# EAGLE design imuv1.4a (EAGLE 7.7.0)
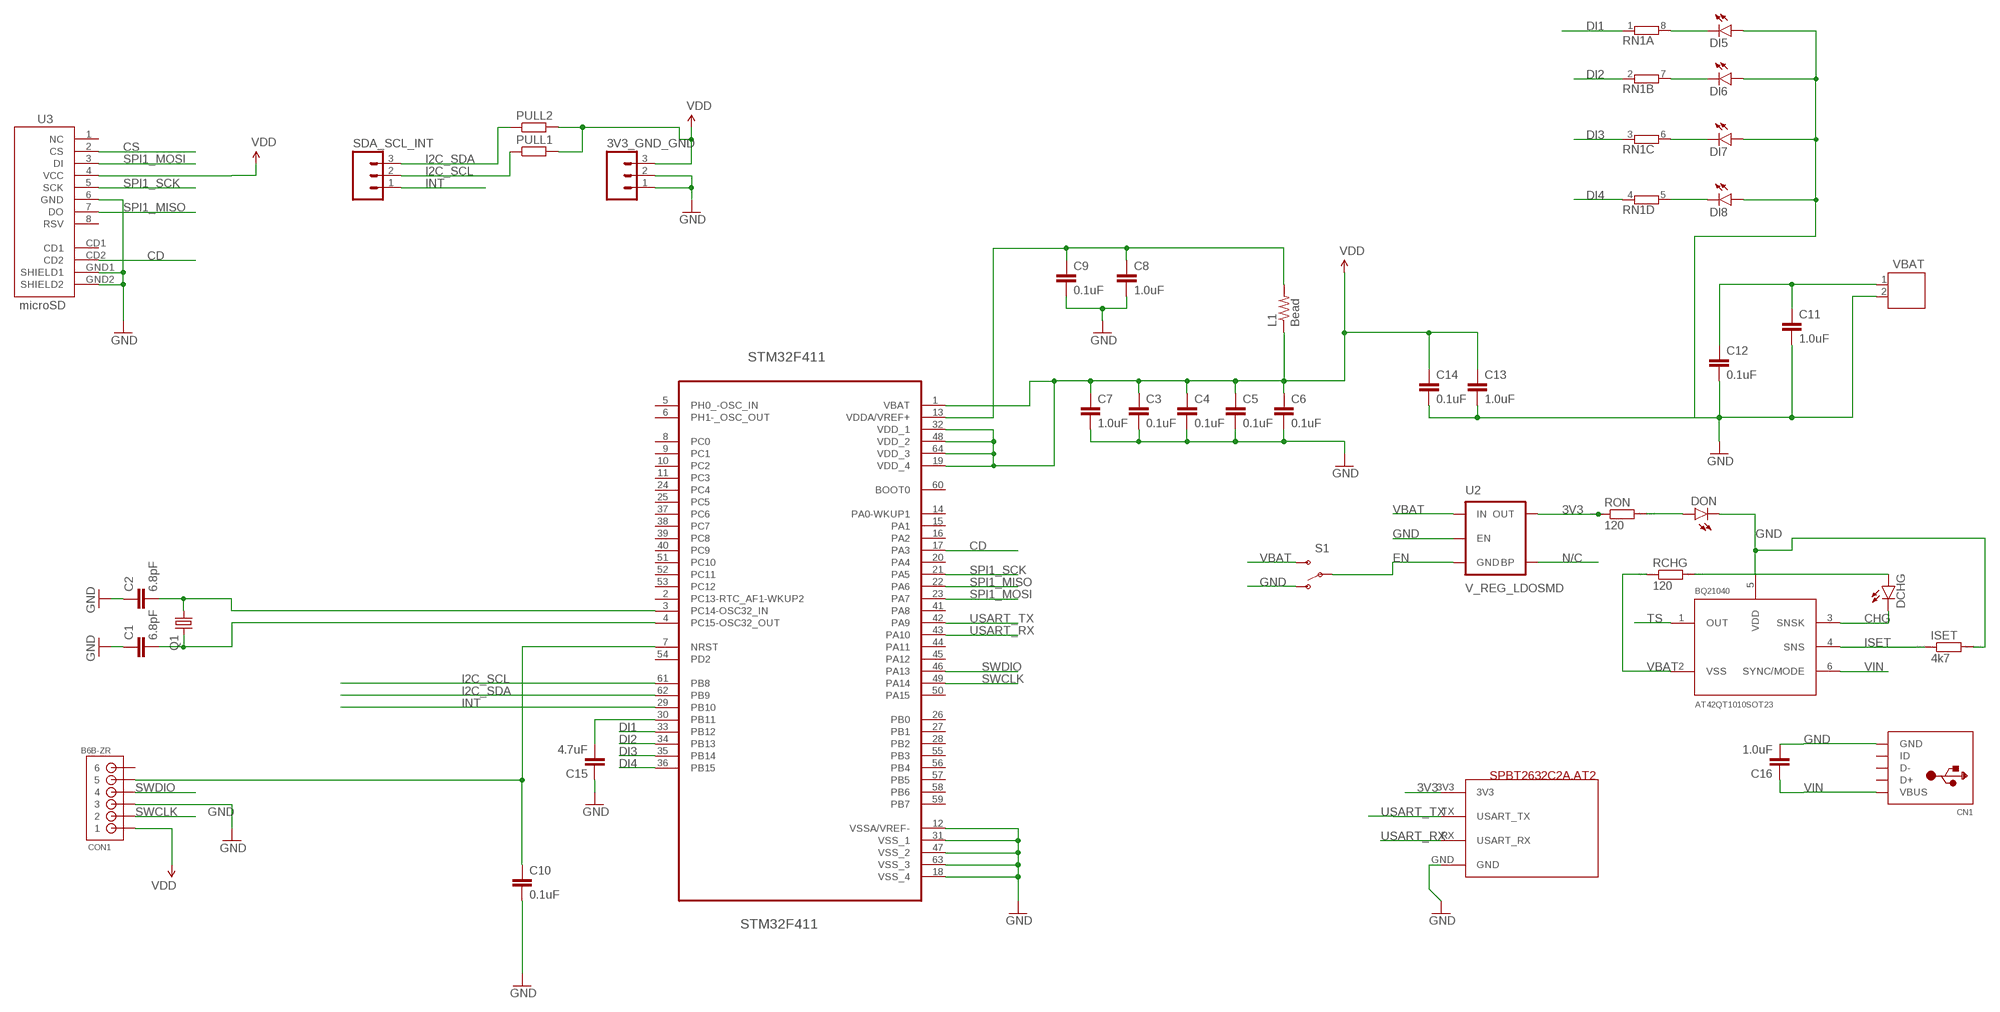
[diagram p0: schematic, sheet 1]

## Parts
3V3_GND_GND  M03PTH  [1X03]
BQ21040  AT42QT1010SOT23  [SOT23-6]
C1  6.8pF  1.0PF-50V(-/+.25PF)(0603)  [0603-CAP]
C2  6.8pF  1.0PF-50V(-/+.25PF)(0603)  [0603-CAP]
C3  0.1uF  0.1UF-100V-10%(0603)  [0603-CAP]
C4  0.1uF  0.1UF-100V-10%(0603)  [0603-CAP]
C5  0.1uF  0.1UF-100V-10%(0603)  [0603-CAP]
C6  0.1uF  0.1UF-100V-10%(0603)  [0603-CAP]
C7  1.0uF  1.0UF-16V-10%(0603)  [0603-CAP]
C8  1.0uF  1.0UF-16V-10%(0603)  [0603-CAP]
C9  0.1uF  0.1UF-100V-10%(0603)  [0603-CAP]
C10  0.1uF  0.1UF-100V-10%(0603)  [0603-CAP]
C11  1.0uF  1.0UF-16V-10%(0603)  [0603-CAP]
C12  0.1uF  0.1UF-100V-10%(0603)  [0603-CAP]
C13  1.0uF  1.0UF-16V-10%(0603)  [0603-CAP]
C14  0.1uF  0.1UF-100V-10%(0603)  [0603-CAP]
C15  4.7uF  4.7UF-16V-20%,+80%-(1206)  [1206-CAP]
C16  1.0uF  1.0UF-16V-10%(0603)  [0603-CAP]
CN1  USBMINIB  [USB-MINIB]
CON1  B6B-ZR  [B6B-ZR]
DCHG  LED0603  [LED-0603]
DI5  LED0603  [LED-0603]
DI6  LED0603  [LED-0603]
DI7  LED0603  [LED-0603]
DI8  LED0603  [LED-0603]
DON  LED0603  [LED-0603]
ISET  4k7  RR0603  [R0603]
L1  Bead  1OHM1/10W1%(0603)  [0603-RES]
PULL1  R-EU_R0603  [R0603]
PULL2  R-EU_R0603  [R0603]
Q1  CRYSTALMM20SS  [MM20SS]
RCHG  120  RR0603  [R0603]
RN1  4R-N0603-ARV  [0603-ARV]
RON  120  RR0603  [R0603]
S1  SWITCH-SPDTPTH  [SWITCH-SPDT]
SDA_SCL_INT  M03PTH  [1X03]
STM32F411  STM32F411  STM32L152RBT6STM32F411  [QFP50P1200X1200X160-64N]
U2  V_REG_LDOSMD  [SOT23-5]
U3  microSD  USD-SOCKETSMD  [MICRO-SD-SOCKET-PP]
U$1  BT  [SPBT2632C2A.AT2_XCVR_SPBT2632C2A.AT2]
VBAT  JST-PH2  [JST-PH2]

## Nets
3V3 [Power]: 3V3_GND_GND.3 C3.1 C4.1 C5.1 C6.1 C7.1 C13.1 C14.1 C15.2 CON1.1 L1.1 PULL1.2 PULL2.2 RON.1 STM32F411.1(VBAT) STM32F411.19(VDD_4) STM32F411.30(PB11) STM32F411.32(VDD_1) STM32F411.48(VDD_2) STM32F411.64(VDD_3) U2.5(OUT) U3.4(VCC) U$1.3V3 ; supply symbol labelled VDD
AREF: C8.1 C9.1 L1.2 STM32F411.13(VDDA/VREF+)
CD: STM32F411.17(PA3) U3.CD2
CHG: BQ21040.3(SNSK) DCHG.C
CS: U3.2(CS)
DI1: RN1.1 STM32F411.33(PB12)
DI2: RN1.2 STM32F411.34(PB13)
DI3: RN1.3 STM32F411.35(PB14)
DI4: RN1.4 STM32F411.36(PB15)
EN: S1.2(P) U2.2(GND)
GND [Power]: 3V3_GND_GND.1 3V3_GND_GND.2 BQ21040.5(VDD) C1.1 C2.1 C3.2 C4.2 C5.2 C6.2 C7.2 C8.2 C9.2 C10.2 C11.2 C12.2 C13.2 C14.2 C15.1 C16.2 CN1.GND CON1.3 DI5.A DI6.A DI7.A DI8.A DON.C ISET.2 S1.1(O) STM32F411.12(VSSA/VREF-) STM32F411.18(VSS_4) STM32F411.31(VSS_1) STM32F411.47(VSS_2) STM32F411.63(VSS_3) U2.3(EN) U3.6(GND) U3.GND1(SHIELD1) U3.GND2(SHIELD2) U$1.GND VBAT.2
I2C_SCL: PULL1.1 SDA_SCL_INT.2 STM32F411.61(PB8)
I2C_SDA: PULL2.1 SDA_SCL_INT.3 STM32F411.62(PB9)
INT: SDA_SCL_INT.1 STM32F411.29(PB10)
ISET: BQ21040.4(SNS) ISET.1
N$1: C1.2 Q1.4 STM32F411.4(PC15-OSC32_OUT)
N$3: DON.A RON.2
N$4: DI5.C RN1.8
N$5: C2.2 Q1.1 STM32F411.3(PC14-OSC32_IN)
N$7: DI6.C RN1.7
N$11: DI7.C RN1.6
N$12: DI8.C RN1.5
N/C: U2.4(BP)
OUT: DCHG.A RCHG.2
RST: C10.1 CON1.5 STM32F411.7(NRST)
SPI1_MISO: STM32F411.22(PA6) U3.7(DO)
SPI1_MOSI: STM32F411.23(PA7) U3.3(DI)
SPI1_SCK: STM32F411.21(PA5) U3.5(SCK)
SWCLK: CON1.2 STM32F411.49(PA14)
SWDIO: CON1.4 STM32F411.46(PA13)
TS: BQ21040.1(OUT)
USART_RX [Signal]: STM32F411.43(PA10) U$1.RX(USART_RX)
USART_TX [Signal]: STM32F411.42(PA9) U$1.TX(USART_TX)
VBAT: BQ21040.2(VSS) C11.1 C12.1 RCHG.1 S1.3(S) U2.1(IN) VBAT.1
VIN: BQ21040.6(SYNC/MODE) C16.1 CN1.VBUS
Unconnected: CN1.D+ CN1.D- CN1.ID CON1.6 STM32F411.2(PC13-RTC_AF1-WKUP2) STM32F411.5(PH0_-OSC_IN) STM32F411.6(PH1-_OSC_OUT) STM32F411.8(PC0) STM32F411.9(PC1) STM32F411.10(PC2) STM32F411.11(PC3) STM32F411.14(PA0-WKUP1) STM32F411.15(PA1) STM32F411.16(PA2) STM32F411.20(PA4) STM32F411.24(PC4) STM32F411.25(PC5) STM32F411.26(PB0) STM32F411.27(PB1) STM32F411.28(PB2) STM32F411.37(PC6) STM32F411.38(PC7) STM32F411.39(PC8) STM32F411.40(PC9) STM32F411.41(PA8) STM32F411.44(PA11) STM32F411.45(PA12) STM32F411.50(PA15) STM32F411.51(PC10) STM32F411.52(PC11) STM32F411.53(PC12) STM32F411.54(PD2) STM32F411.55(PB3) STM32F411.56(PB4) STM32F411.57(PB5) STM32F411.58(PB6) STM32F411.59(PB7) STM32F411.60(BOOT0) U3.1(NC) U3.8(RSV) U3.CD1

## Library data of the parts
3V3_GND_GND SDA_SCL_INT = SparkFun-Connectors:M03: Header 3 Standard 3-pin 0.1" header. Use with straight break away headers (SKU : PRT-00116), right angle break away headers (PRT-00553), swiss pins (PRT-00743), machine pins (PRT-00117), and female headers (PRT-00115). Molex polarized connector foot print use with SKU : PRT-08232 with associated crimp pins and housings.
BQ21040 = SparkFun-DigitalIC:AT42QT1010
C1 C2 = SparkFun-Capacitors:1.0PF-50V(-/+.25PF)(0603): CAP-07879; PROD_ID: CAP-07879; VALUE: 1.0pF
C3-C6 C9 C10 C12 C14 = SparkFun-Capacitors:0.1UF-100V-10%(0603): CAP-08390; PROD_ID: CAP-08390
C7 C8 C11 C13 C16 = SparkFun-Capacitors:1.0UF-16V-10%(0603): CAP-00868; PROD_ID: CAP-00868
C15 = SparkFun-Capacitors:4.7UF-16V-20%,+80%-(1206): CAP-10300; PROD_ID: CAP-10300
CN1 = adafruit:USB: USB Connectors USBMINIB - Surface Mount Female Mini-B USB Connector 4UConnector: 06564 By microbuilder.eu Thru-hole RA Female Mini-B USB Connector 4UConnector: 18732 By ladyada.net
CON1 = jst:B6B-ZR: JST-ZH Connector 6 pol, 1.5mm pitch Package: B6B-ZR Source: http://www.jst-mfg.com/product/pdf/eng/eZH.pdf
DCHG DI5-DI8 DON = SparkFun-LED:LED: LEDs Standard schematic elements and footprints for 5mm, 3mm, 1206, and 0603 sized LEDs. 5mm - Spark Fun Electronics SKU : COM-00529 (and others)
ISET RCHG RON = eagle-ltspice:R: RESISTOR, European symbol; SPICEMODEL: NONE; SPICEPREFIX: R
L1 = SparkFun-Resistors:1OHM1/10W1%(0603): RES-08269; PROD_ID: RES-08269; VALUE: 1
PULL1 PULL2 = resistor:R-EU_: RESISTOR, European symbol
Q1 = crystal:CRYSTAL: CRYSTAL; OC_FARNELL: unknown; OC_NEWARK: unknown
RN1 = resistor-dil:4R-N: Array Chip Resistor Source: RS Component / Phycomp; OC_FARNELL: unknown; OC_NEWARK: unknown
S1 = SparkFun-Electromechanical:SWITCH-SPDT: SPDT Switch Simple slide switch, Spark Fun Electronics SKU : COM-00102 DPDT SMT slide switch, AYZ0202, SWCH-08179; PROD_ID: SWCH-08261
STM32F411 = ST Microelctronics_By_element14_Batch_1:STM32L152RBT6: ARM-based 32-bit MCU STM32F411; STM32F411: STM32F411
U2 = SparkFun-PowerIC:V_REG_LDO: Voltage Regulator LDO Standard 150mA LDO voltage regulator in SOT-23 layout. Micrel part MIC5205. BP (by-pass) pin is used to lower output noise with 470pF cap.
U3 = SparkFun:USD-SOCKET: microSD Socket Push-push type uSD socket. Schematic element and footprint production proven. Spark Fun Electronics SKU : PRT-00127. tDoc lines correctly indicate media card edge positions when inserting (unlocked, locked, depressed).
U$1 = STM32L152RBT6_Cap:BT
VBAT = jst-ph:JST-PH2

## Net classes
0 default: width 0.152 mm, clearance 0.152 mm
1 Power: width 0.203 mm, clearance 0.152 mm
2 Signal: width 0.152 mm

## Board
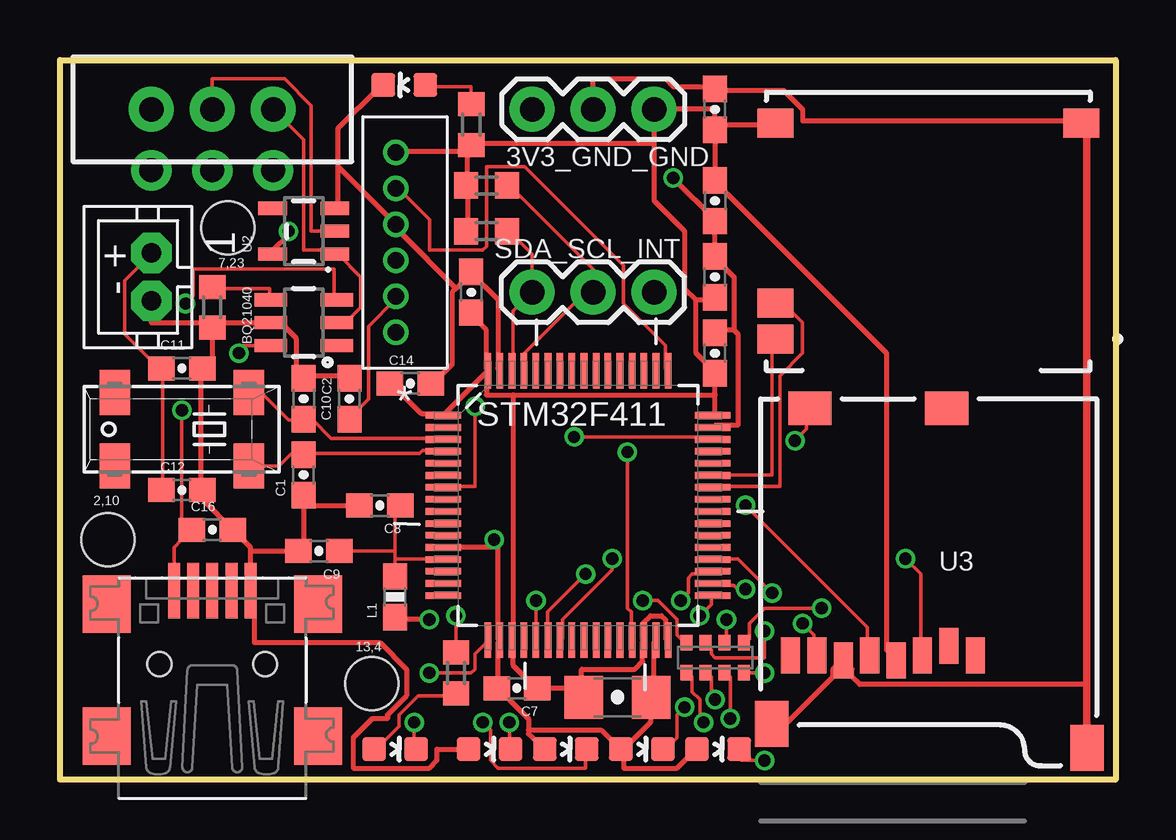
[diagram p1: board, top side]
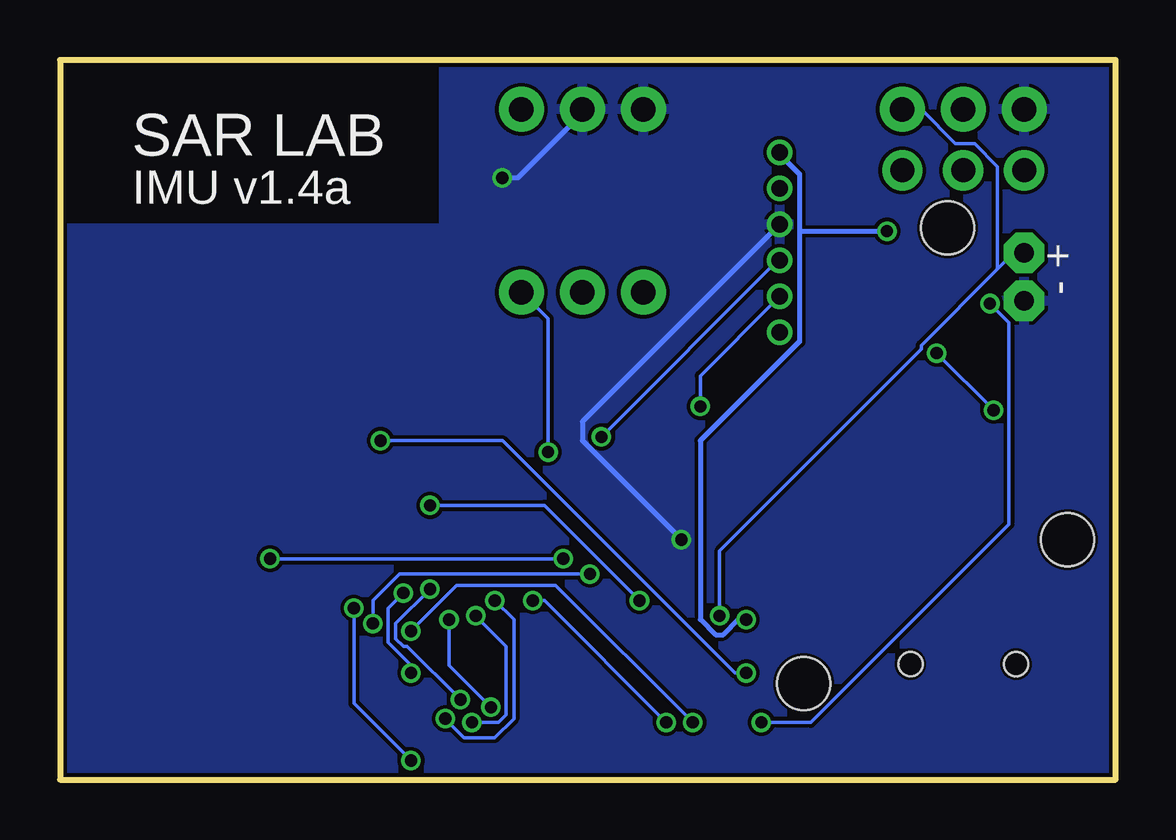
[diagram p2: board, bottom side, seen from below]

Size 44 x 30 mm. Coordinates in mm from the lower left corner, seen from the top.
Outline: 0,0 0,30 44,30 44,0 0,0
Copper layers (1*16): Top 0.035mm / dielectric 1.5mm / Bottom 0.035mm
Design rules "SparkFun *": minimum track width 6mil, minimum drill 20mil, track to track 6mil, track to pad 6mil, pad to pad 6mil, via to via 6mil, smd to smd 6mil, copper to edge 6mil, drill to drill 8mil, minimum pad ring 6mil, minimum via ring 6mil, stop-mask expansion 4mil, vias tented up to drill 25mil, thermal gap 6mil
Holes 2.2 mm at 2,10 13,4 7,23

### Footprints (pad centres in the part's own frame; a part is rotated, then mirrored left to right if it is on the bottom)
1X03 = drill 1.016 pad 1.88: 1 0,0; 2 2.54,0; 3 5.08,0
SOT23-6 = smd 0.55 x 1.35: 1 -0.95,-1.375; 2 0,-1.375; 3 0.95,-1.375; 4 0.95,1.375; 5 0,1.375; 6 -0.95,1.375
0603-CAP = smd 1.1 x 1: 1 -0.85,0; 2 0.85,0
1206-CAP = smd 1.6 x 1.8: 1 -1.4,0; 2 1.4,0
USB-MINIB = smd 0.5 x 2.308: D+ 0,4.064; D- -0.8,4.064; GND 1.6,4.064; ID 0.8,4.064; VBUS -1.6,4.064 | smd 2 x 2.4: GND1 -4.4,-2; GND2 -4.4,3.5; GND3 4.4,3.5; GND4 4.4,-2 | hole 1: -2.2,1; 2.2,1
B6B-ZR = drill 0.7: 1 9,-1.3; 2 7.5,-1.3; 3 6,-1.3; 4 4.5,-1.3; 5 3,-1.3; 6 1.5,-1.3
LED-0603 = smd 1 x 1: A 0,-0.877; C 0,0.877
R0603 = smd 1 x 1.1: 1 -0.85,0; 2 0.85,0
0603-RES = smd 1.1 x 1: 1 -0.85,0; 2 0.85,0
MM20SS = smd 1.27 x 1.88: 1 -2.794,-1.524; 2 2.794,-1.524; 3 2.794,1.524; 4 -2.794,1.524
0603-ARV = smd 0.5 x 0.65: 1 -1.2,-0.625; 2 -0.4,-0.625; 3 0.4,-0.625; 4 1.2,-0.625; 5 1.2,0.625; 6 0.4,0.625; 7 -0.4,0.625; 8 -1.2,0.625
SWITCH-SPDT = drill 1.016 pad 1.88: 1 0,2.54; 2 0,0; 3 0,-2.54
QFP50P1200X1200X160-64N = smd 1.473 x 0.279: 1 -5.613,3.759; 2 -5.613,3.251; 3 -5.613,2.743; 4 -5.613,2.261; 5 -5.613,1.753; 6 -5.613,1.245; 7 -5.613,0.762; 8 -5.613,0.254; 9 -5.613,-0.254; 10 -5.613,-0.762; 11 -5.613,-1.245; 12 -5.613,-1.753; 13 -5.613,-2.261; 14 -5.613,-2.743; 15 -5.613,-3.251; 16 -5.613,-3.759; 33 5.613,-3.759; 34 5.613,-3.251; 35 5.613,-2.743; 36 5.613,-2.261; 37 5.613,-1.753; 38 5.613,-1.245; 39 5.613,-0.762; 40 5.613,-0.254; 41 5.613,0.254; 42 5.613,0.762; 43 5.613,1.245; 44 5.613,1.753; 45 5.613,2.261; 46 5.613,2.743; 47 5.613,3.251; 48 5.613,3.759 | smd 0.279 x 1.473: 17 -3.759,-5.613; 18 -3.251,-5.613; 19 -2.743,-5.613; 20 -2.261,-5.613; 21 -1.753,-5.613; 22 -1.245,-5.613; 23 -0.762,-5.613; 24 -0.254,-5.613; 25 0.254,-5.613; 26 0.762,-5.613; 27 1.245,-5.613; 28 1.753,-5.613; 29 2.261,-5.613; 30 2.743,-5.613; 31 3.251,-5.613; 32 3.759,-5.613; 49 3.759,5.613; 50 3.251,5.613; 51 2.743,5.613; 52 2.261,5.613; 53 1.753,5.613; 54 1.245,5.613; 55 0.762,5.613; 56 0.254,5.613; 57 -0.254,5.613; 58 -0.762,5.613; 59 -1.245,5.613; 60 -1.753,5.613; 61 -2.261,5.613; 62 -2.743,5.613; 63 -3.251,5.613; 64 -3.759,5.613
SOT23-5 = smd 0.55 x 1.2: 1 -0.95,-1.3; 2 0,-1.3; 3 0.95,-1.3; 4 0.95,1.3; 5 -0.95,1.3
MICRO-SD-SOCKET-PP = smd 0.8 x 1.5: 1 -8.94,10.7; 2 -7.84,10.3; 3 -6.74,10.7; 4 -5.64,10.9; 5 -4.54,10.7; 6 -3.44,10.9; 7 -2.34,10.7; 8 -1.24,10.7 | smd 1.8 x 1.4: CD1 -7.75,0.4; CD2 -2.05,0.4 | smd 1.4 x 1.9: GND1 -13.6,14.55; GND2 -0.45,13.55
SPBT2632C2A.AT2_XCVR_SPBT2632C2A.AT2 = smd 1.5 x 1.2: 3V3 6.37,-4.5; GND -6.37,-4.5; RX 6.37,4.5; TX 6.37,3
JST-PH2 = drill 0.813 pad 1.676 octagon: 1 1,0; 2 -1,0

### Placement (x,y rotation side)
3V3_GND_GND  19.68,27.94 0 top
BQ21040  10.16,19.05 90 top
C1  10.16,12.7 90 top
C2  10.16,15.88 270 top
C3  27.3,20.95 90 top
C4  27.3,27.94 90 top
C5  17.14,20.32 90 top
C6  27.3,17.78 90 top
C7  19.05,3.81 180 top
C8  13.34,11.43 180 top
C9  10.79,9.53 180 top
C10  12.06,15.88 90 top
C11  5.08,17.14 0 top
C12  5.08,12.06 0 top
C13  27.3,24.13 270 top
C14  14.61,16.51 0 top
C15  23.24,3.43 180 top
C16  6.35,10.41 0 top
CN1  6.35,3.81 0 top
CON1  12.7,17.14 90 top
DCHG  13.97,1.27 270 top
DI5  17.91,1.27 270 top
DI6  21.08,1.27 270 top
DI7  24.26,1.27 270 top
DI8  27.43,1.27 270 top
DON  14.35,28.96 90 top
ISET  6.35,19.68 270 top
L1  13.97,7.62 90 top
PULL1  17.78,24.77 180 top
PULL2  17.78,22.86 180 top
Q1  5.08,14.61 180 top
RCHG  16.51,4.45 270 top
RN1  27.3,5.08 0 top
RON  17.14,27.3 90 top
S1  6.35,27.94 90 top
SDA_SCL_INT  24.77,20.32 180 top
STM32F411  21.59,11.43 0 top
U2  10.16,22.86 90 top
U3  29.21,15.88 180 top
U$1  36.2,22.86 180 top
VBAT  3.81,20.95 90 top

### Tracks (layer width: path | path; a pad name or v marks a point on that pad's centre or on a via)
3V3  (via drill 0.51)
  Top 0.203: 21.75,3.81 20,3.81 C7.1 19.84,3.81 18.89,4.76 18.89,5.71 STM32F411.19 18.89,5.87 18.89,16.03 | 21.75,3.81 21.75,3.49 C15.2 21.75,3.81 | 21.75,3.81 21.75,4.6 23.97,4.6 24.29,4.92 24.29,5.71 STM32F411.30 24.29,5.87 24.29,6.51 24.61,6.83 25.08,6.83 25.24,6.67 25.24,5.87 STM32F411.32 | 27.3,16.03 27.3,15.24 STM32F411.48 | 27.3,16.03 27.3,16.83 C6.1 27.3,16.99 26.51,17.78 26.51,20 | 26.51,20 27.3,20 C3.1 | C5.1 17.14,19.37 17.78,18.73 17.78,17.14 STM32F411.64 | C14.1 13.81,16.51 15.08,15.24 15.88,15.24 STM32F411.1 16.03,15.24 17.78,16.99 | 17.78,16.99 STM32F411.64 | 18.89,16.03 17.78,16.03 17.78,16.99 | 18.89,16.03 27.3,16.03 | 17.78,16.99 STM32F411.64 | 16.99,24.77 16.99,22.86 PULL2.2 | 16.99,24.77 PULL1.2 16.99,24.77 | 16.99,26.19 17.14,26.35 RON.1 | 16.99,24.77 16.99,26.19 | v15.4,6.67 13.97,6.67 L1.1 | v9.53,22.86 9.53,22.7 8.89,22.07 U2.5 | 16.99,26.19 14.13,26.19 CON1.1 | 16.99,26.19 RON.1 | C4.1 27.3,26.99 27.3,25.08 C13.1 27.3,24.92 34.45,17.78 34.45,5.4 34.77,5.08 U3.4 | 27.3,27.3 29.69,27.3 U$1.3V3 | 27.3,27.3 27.3,27.15 C4.1 | 27.3,27.3 27.3,27.94 3V3_GND_GND.3 24.77,26.51 | 27.3,27.3 C4.1 | 24.77,26.51 17.14,26.51 RON.1 | 26.51,20 26.04,20.48 26.04,22.86 24.77,24.13 24.77,26.51
  Bottom 0.203: v15.4,6.67 15.72,6.67 16.35,6.03 16.67,6.03 17.3,6.67 17.3,14.13 13.18,18.26 13.18,22.86 | 13.18,22.86 13.18,25.24 13.97,26.04 CON1.1 | 13.18,22.86 v9.53,22.86
AREF
  Top 0.152: 13.97,9.53 11.75,9.53 C9.1 | 13.97,9.21 13.97,8.57 L1.2 | 13.97,9.21 13.97,9.53 | 13.97,9.53 13.97,11.27 14.13,11.43 C8.1 | 13.97,9.21 15.88,9.21 STM32F411.13
CD  (via drill 0.51)
  Top 0.152: v15.4,4.45 17.14,4.45 17.3,4.6 17.3,5.24 17.78,5.71 STM32F411.17 | v30.64,14.13 31.11,14.61 31.11,15.4 U3.CD2
  Bottom 0.152: v15.4,4.45 15.88,4.45 25.56,14.13 v30.64,14.13
CHG  (via drill 0.51)
  Top 0.152: v14.76,2.38 14.76,1.27 DCHG.C | v5.24,19.84 5.56,20.16 5.56,21.27 11.43,21.27 11.43,20 BQ21040.3
  Bottom 0.152: v14.76,2.38 12.7,2.38 4.45,10.64 4.45,19.05 v5.24,19.84
DI1  (via drill 0.51)
  Top 0.152: v26.83,2.38 26.67,2.54 26.67,3.33 26.35,3.65 26.35,4.29 26.19,4.45 RN1.1 | v26.67,6.83 27.15,7.3 27.15,7.62 STM32F411.33
  Bottom 0.152: v26.83,2.38 25.72,2.38 25.4,2.7 25.4,5.56 v26.67,6.83
DI2  (via drill 0.51)
  Top 0.152: v27.3,3.33 27.15,3.49 27.15,4.29 26.99,4.45 RN1.2 | v28.57,7.94 28.26,7.94 28.1,8.1 27.3,8.1 STM32F411.34
  Bottom 0.152: v27.3,3.33 29.53,5.56 29.69,5.56 30,5.87 30,6.51 v28.57,7.94
DI3  (via drill 0.51)
  Top 0.152: v27.94,2.54 27.94,4.29 27.78,4.45 RN1.3 | v25.88,7.46 26.19,7.78 26.19,8.41 26.35,8.57 27.15,8.57 STM32F411.35
  Bottom 0.152: v27.94,2.54 27.15,1.75 25.88,1.75 25.08,2.54 25.08,6.67 v25.88,7.46
DI4  (via drill 0.51)
  Top 0.152: v29.37,4.45 28.57,4.45 RN1.4 | v29.69,7.78 28.26,9.21 27.3,9.21 STM32F411.36
  Bottom 0.152: v29.37,4.45 29.37,4.76 30.32,5.71 30.32,7.14 v29.69,7.78
EN
  Top 0.152: S1.2 6.35,29.21 9.37,29.21 10.48,28.1 10.48,22.86 11.43,22.86 U2.2
GND  (via drill 0.51)
  Top 0.203: 10.16,11.43 10.16,11.75 C1.1 10.16,11.43 | 10.16,11.43 10.16,9.68 10,9.53 C9.2 9.84,9.53 7.94,9.53 | 10.16,11.43 12.38,11.43 C8.2 | DI5.A 16.99,1.27 15.72,1.27 15.72,0.79 15.4,0.48 12.22,0.48 12.22,1.75 13.02,2.54 13.65,2.54 13.65,2.7 14.45,3.49 14.45,4.6 13.34,5.71 8.1,5.71 8.1,7.78 CN1.GND 7.94,7.94 7.94,9.53 | 7.94,9.53 7.94,9.68 7.3,10.32 C16.2 7.14,10.48 6.03,11.59 6.03,12.06 C12.2 5.87,12.06 5.87,17.14 C11.2 6.03,17.14 6.35,17.46 6.35,18.73 ISET.2 | 23.5,1.27 24.61,2.38 24.61,3.33 C15.1 24.77,3.49 24.77,5.71 STM32F411.31 | 23.5,1.27 DI7.A | 23.5,1.27 23.5,0.48 25.72,0.48 26.51,1.27 DI8.A | 23.5,1.27 DI7.A | 19.53,2.06 19.53,2.54 18.26,3.81 | 19.53,2.06 19.53,1.91 20.16,1.27 DI6.A | 18.26,3.81 C7.2 18.26,3.81 | 18.26,3.81 18.26,5.71 STM32F411.18 18.26,5.87 18.26,9.68 18.1,9.68 | 18.1,9.68 16.03,9.68 STM32F411.12 | 19.53,2.06 22.54,2.06 23.34,1.27 DI7.A | U3.GND2 29.69,2.38 30.32,2.38 32.23,4.29 32.23,4.6 32.54,4.92 U3.6 32.7,4.92 33.02,4.6 33.02,4.29 33.34,3.97 42.7,3.97 42.81,3.97 | 28.1,18.73 27.3,18.73 C6.2 | 28.1,18.73 28.1,20.95 27.3,21.75 C3.2 27.3,21.91 27.3,23.18 C13.2 27.3,23.34 v25.56,25.08 | 28.1,18.73 28.26,18.57 28.26,14.76 27.3,14.76 STM32F411.47 | 10.16,16.83 12.06,16.83 C10.2 | 10.16,16.83 C2.1 10.16,16.83 | 6.35,19.05 8.73,19.05 BQ21040.5 8.89,19.05 9.21,19.05 9.84,18.41 9.84,17.14 10.16,16.83 | 6.35,19.05 6.35,18.89 ISET.2 | 17.14,21.11 16.51,20.48 | 16.51,20.48 16.35,20.32 16.35,17.3 15.56,16.51 C14.2 | 17.14,21.11 C5.2 17.14,21.11 | 17.14,21.11 18.26,20 18.26,17.14 STM32F411.63 | 3V3_GND_GND.2 22.23,29.21 25.24,29.21 25.56,28.89 27.3,28.89 C4.2 27.3,28.73 30.16,28.73 30.96,27.94 30.96,27.46 42.55,27.46 U$1.GND
  Top 0.203: 11.59,25.56 11.59,23.81 U2.3 | 11.59,25.56 11.59,27.15 13.34,28.89 DON.C | 11.59,25.56 13.97,23.18 CON1.3 14.13,23.02 14.13,22.86 16.51,20.48 | 6.35,19.05 3.81,19.05 3.81,19.84 VBAT.2 | 6.35,19.05 ISET.2 | v18.1,10 18.1,9.68
  Top 0.305: U3.GND1 42.81,3.97 42.81,27.11 U$1.GND
  Bottom 0.203: v25.56,25.08 24.92,25.08 22.23,27.78 3V3_GND_GND.2 | v18.1,10 22.23,14.13 22.23,14.92 14.13,23.02 CON1.3
  pour Bottom: 0,0 44,0 44,23 28,23 28,30 0,30
I2C_SCL
  Top 0.152: 22.23,20.64 SDA_SCL_INT.2 22.23,20.64 | 22.23,20.64 22.23,21.27 18.73,24.77 PULL1.1 | 22.23,20.64 19.37,17.78 19.37,17.14 STM32F411.61
I2C_SDA
  Top 0.152: PULL2.1 18.73,22.86 19.68,21.91 SDA_SCL_INT.3 18.89,19.53 18.89,17.14 STM32F411.62
INT  (via drill 0.51)
  Top 0.152: v23.65,13.65 23.65,7.14 23.81,6.99 23.81,5.87 STM32F411.29
  Bottom 0.152: v23.65,13.65 23.65,19.21 SDA_SCL_INT.1
ISET
  Top 0.152: ISET.1 6.35,20.48 8.73,20.48 8.73,20 BQ21040.4
N$1
  Top 0.152: Q1.4 9.14,13.08 9.65,13.59 10.16,13.59 | 10.16,13.59 14.99,13.59 15.11,13.72 15.95,13.72 STM32F411.4 | 10.16,13.59 10.16,13.65 10.16,13.59 | 10.16,13.59 C1.2
N$3
  Top 0.152: DON.A 15.24,28.89 17.14,28.89 17.14,28.26 RON.2
N$4  (via drill 0.51)
  Top 0.152: v24.29,7.46 24.92,7.46 25.72,6.67 25.72,6.03 26.04,5.71 RN1.8 | v18.73,2.38 18.73,1.27 DI5.C
  Bottom 0.152: v24.29,7.46 23.81,7.46 v18.73,2.38
N$5
  Top 0.152: Q1.1 8.38,16.13 9.53,14.99 10.12,14.99 C2.2 10.5,15.03 11.3,14.22 15.93,14.22 STM32F411.3
N$7  (via drill 0.51)
  Top 0.152: v29.37,6.19 29.37,5.08 27.3,5.08 27.15,5.24 27.15,5.4 26.99,5.56 RN1.7 | v17.62,2.38 17.94,2.06 17.94,0.79 18.26,0.48 21.91,0.48 21.91,1.27 DI6.C
  Bottom 0.152: v29.37,6.19 27.46,8.1 23.34,8.1 v17.62,2.38
N$8  (via drill 1 pad 1.68)
  other vias: 3.81,25.4
N$9  (via drill 1 pad 1.68)
  other vias: 6.35,25.4
N$10  (via drill 1 pad 1.68)
  other vias: 8.89,25.4
N$11  (via drill 0.51)
  Top 0.152: v27.78,6.67 27.78,5.71 RN1.6 | v26.04,3.02 25.72,2.7 25.72,1.75 25.24,1.27 DI7.C
  Bottom 0.152: v27.78,6.67 27.78,4.76 v26.04,3.02
N$12  (via drill 0.51)
  Top 0.152: v31.75,7.14 29.37,7.14 28.73,6.51 28.73,5.87 28.57,5.71 RN1.5 | v29.37,0.79 28.42,0.79 28.42,1.27 DI8.C
  Bottom 0.152: v31.75,7.14 31.75,3.17 v29.37,0.79
OUT
  Top 0.152: DCHG.A 13.18,1.27 14.13,2.22 14.13,2.7 14.92,3.49 16.51,3.49 RCHG.2
RST  (via drill 0.51)
  Top 0.152: C10.1 12.06,15.08 12.86,15.88 12.86,18.89 13.97,20 CON1.5 | v17.3,15.56 17.3,12.22 16.03,12.22 STM32F411.7
  Bottom 0.152: v17.3,15.56 17.3,16.83 14.13,20 CON1.5
SPI1_MISO  (via drill 0.51)
  Top 0.152: v21.91,8.57 20.32,6.99 20.32,5.87 STM32F411.22 | v30.96,6.51 31.43,6.03 31.43,5.24 U3.7
  Bottom 0.152: v21.91,8.57 29.84,8.57 30.96,7.46 v30.96,6.51
SPI1_MOSI  (via drill 0.51)
  Top 0.152: v23.02,9.21 23.02,8.73 20.95,6.67 20.95,5.87 STM32F411.23 | v35.24,9.21 35.88,8.57 35.88,5.24 U3.3
  Bottom 0.152: v35.24,9.21 v23.02,9.21
SPI1_SCK  (via drill 0.51)
  Top 0.152: v19.84,7.46 19.84,5.87 STM32F411.21 | v28.57,11.43 33.66,6.35 33.66,5.24 U3.5
  Bottom 0.152: v19.84,7.46 23.81,11.43 v28.57,11.43
SWCLK
  Top 0.152: STM32F411.49 25.24,17.14 25.24,18.1 23.5,19.84 23.5,21.43 19.37,25.56 17.78,25.56 17.78,22.23 17.62,22.07 15.4,22.07 15.4,23.34 14.13,24.61 CON1.2
SWDIO  (via drill 0.51)
  Top 0.152: v21.43,14.29 27.15,14.29 STM32F411.46
  Bottom 0.152: v21.43,14.29 14.13,21.59 CON1.4
USART_RX
  Top 0.152: STM32F411.43 27.3,12.7 29.69,12.7 29.69,18.26 U$1.RX
USART_TX
  Top 0.152: STM32F411.42 27.3,12.22 30,12.22 30,16.83 30.96,17.78 30.96,19.05 30.16,19.84 29.84,19.84 U$1.TX
VBAT  (via drill 0.51)
  Top 0.152: BQ21040.2 11.59,19.05 11.91,19.05 12.54,19.68 12.54,20.95 11.59,21.91 U2.1 11.43,22.07 10.16,22.07 10.16,26.67 S1.3 | C12.1 4.29,12.06 4.29,17.14 C11.1 4.13,17.14 2.7,18.57 2.7,20.8 3.81,21.91 VBAT.1 | v16.51,6.83 16.51,5.4 RCHG.1
  Bottom 0.152: v16.51,6.83 16.51,9.53 8.1,17.94 8.1,18.1 4.92,21.27 | 4.92,21.27 4.29,21.91 3.81,21.91 VBAT.1 | S1.3 8.1,27.94 6.67,26.51 5.87,26.51 4.92,25.56 4.92,21.27
VIN  (via drill 0.51)
  Top 0.152: 5.08,10 4.76,9.68 4.76,7.94 CN1.VBUS | 5.08,10 5.4,10.32 C16.1 5.08,10 | v7.46,17.78 7.46,18.1 8.73,18.1 BQ21040.6 | 5.08,10 v5.08,15.4
  Bottom 0.152: v5.08,15.4 v7.46,17.78

### Text on the board
bPlace: SAR LAB | IMU v1.4a
tNames: - + | 7,23 | 2,10 | 13,4
bNames: - +